# Altium schematic sheet RTC.SchDoc
size 209 x 297 mm; SheetNumber: 16; SheetTotal: 25
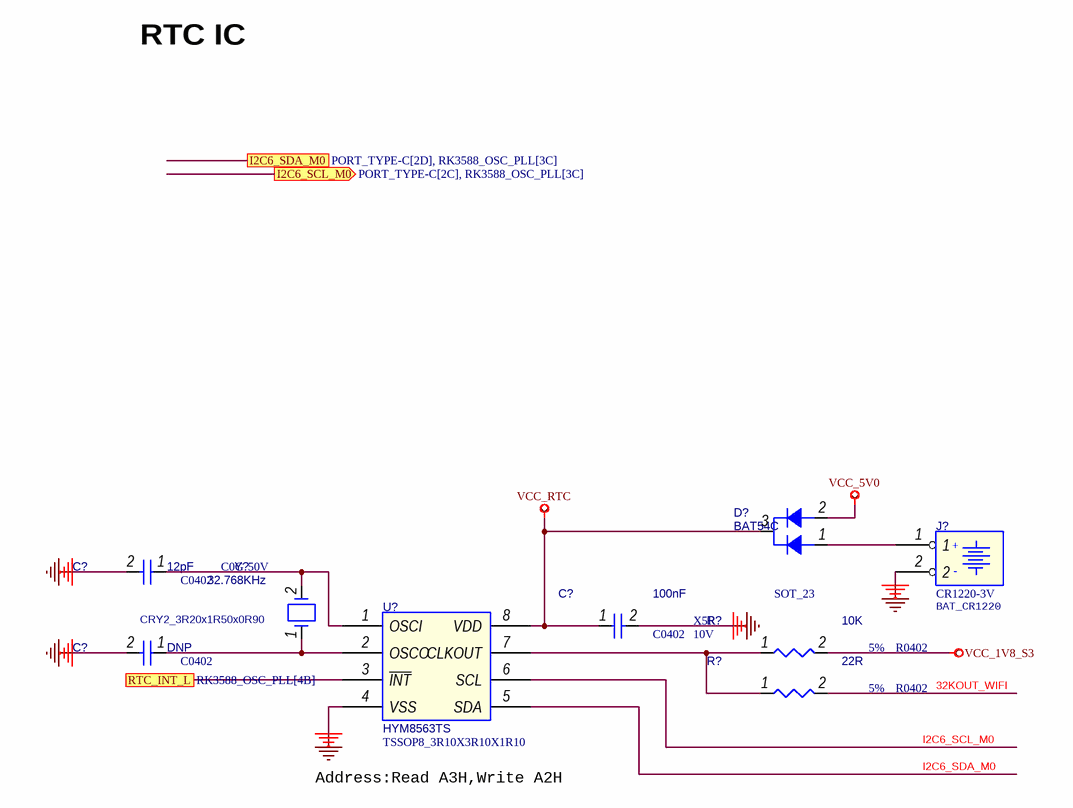
[diagram p0: RTC.SchDoc]

## Parts
(Parts that share a designator on the sheet are numbered #1, #2 ... from top to bottom, then left to right.)
C?#1  12pF  Dielectric: C0G  Voltage: 50V  [C0402]
C?#2  DNP  [C0402]
C?#3  100nF  Dielectric: X5R  Voltage: 10V  [C0402]
D?  BAT54C  [SOT_23]
J?  CR1220-3V  PCB Footprint: BAT_CR1220  [BATTERY-20MM]
R?#1  10K  Tolerance: 5%  [R0402]
R?#2  22R  Tolerance: 5%  [R0402]
U?  HYM8563TS  [TSSOP8_3R10X3R10X1R10]
Y?  32.768KHz  [CRY2_3R20x1R50x0R90]

## Ports
I2C6_SCL_M0 (out, see PORT_TYPE-C[2C], RK3588_OSC_PLL[3C]), I2C6_SDA_M0 (see PORT_TYPE-C[2D], RK3588_OSC_PLL[3C]), RTC_INT_L (see RK3588_OSC_PLL[4B])

## Nets
GND: C?#1.2 C?#2.2 C?#3.2 J?.2 U?.4(VSS)
VCC_1V8_S3: R?#1.2
VCC_5V0: D?.2(A2)
VCC_RTC: C?#3.1 D?.3(K) U?.8(VDD)
32KOUT_WIFI: R?#2.2
I2C6_SCL_M0: U?.6(SCL)
I2C6_SDA_M0: U?.5(SDA)
RTC_INT_L: U?.3(~{INT}) ; port RTC_INT_L
NetC?#1_1: C?#1.1 U?.1(OSCI) Y?.2
NetC?#2_1: C?#2.1 U?.2(OSCO) Y?.1
NetD?_1: D?.1(A1) J?.1
NetR?#1_1: R?#1.1 R?#2.1 U?.7(CLKOUT)

## Notes on the sheet
- RTC IC
- Address:Read A3H,Write A2H
- 297x210
- Формат А4
- (in symbol CON_BATTERY-20MM) +; -

## Library data of the parts
C?#1 = CAP NP_Dup1: cap,12.00pF,+/-5%,50V,C0G,C0402; Part Reference: C2400; Manufacturer PN: C1005C0G1H120J050BA; Manufacturer: TDK; Tolerance: 5%; Priority: A; PCB Footprint: C0402; Value: 12pF; Created by: JJJ; Part Type: C0402; RK PN: C1005C0G1H120J050BA
C?#2 = CAP NP_Dup1: Did Not Place.; Part Reference: C2402; Manufacturer PN: DNPC0402; Priority: A; PCB Footprint: C0402; Value: DNP; Created by: JJJ; Part Type: DNP; RK PN: DNPC0402
C?#3 = CAP NP_Dup1: cap,100.00nF,+/-10%,10V,X5R,C0402; Part Reference: C2401; Manufacturer PN: C1005X5R1A104K050BA; Manufacturer: TDK; C_Voltage: 6.3V; Tolerance: 10%; Priority: A; Number: 37; PCB Footprint: C0402; Value: 100nF; Created by: JJJ; Part Type: C0402; RK PN: C1005X5R1A104K050BA
D? = DIODE Double: Dual Schottky barrierЈ¬BAT54C SOT-23 Schottky Barrier; Part Reference: D2400; Manufacturer: і¤µз; Priority: A; PCB Footprint: SOT_23; Value: BAT54C; Created by: JJJ; Manufacturer PN: BAT54C; Part Type: Schottky rectifier; RK PN: BAT54C
J? = CON_BATTERY-20MM: Part Reference: J2400; Value: CR1220-3V
R?#1 = RESISTOR_Dup2: НЁУГєсД¤µзЧи,10K,+/-5%,R0402,1/16W.; Part Reference: R2410; Manufacturer PN: RC0402JR-0710KL; Manufacturer: YAGEO; Wattage: 1/16W; Priority: A; PCB Footprint: R0402; Value: 10K; Created by: YTL; Part Type: НЁУГєсД¤µзЧи; RK PN: RC0402JR-0710KL
R?#2 = RESISTOR_Dup2: НЁУГєсД¤µзЧи,22R,+/-5%,R0402,1/16W.; Part Reference: R2400; Manufacturer: YAGEO; RK PN: RC0402JR-0722RL; Priority: A; Wattage: 1/16W; PCB Footprint: R0402; Value: 22R; Part Type: НЁУГєсД¤µзЧи; Manufacturer PN: RC0402JR-0722RL; Created by: YTL
U? = RTC_HYM8563: I2C Real Time Clock/Calendar; Part Reference: U2400; Manufacturer: HaoyuЈЁк»кЕОўµзЧУЈ©; Priority: A; PCB Footprint: TSSOP8_3R10X3R10X1R10; Value: HYM8563TS; RK PN: HYM8563TS; Part Type: RTC; Manufacturer PN: HYM8563TS; Created by: JJJ
Y? = CRYSTAL_2P: ОЮФґѕ§ХсЈ¬32.768KHz,ЎА20ppmЈ¬12.5pF; Part Reference: Y2400; Manufacturer: TKD(М©ѕ§); RK PN: SF-3215; Priority: A; PCB Footprint: CRY2_3R20x1R50x0R90; Value: 32.768KHz; Part Type: CRYSTAL; Manufacturer PN: SF-3215; Created by: YWQ